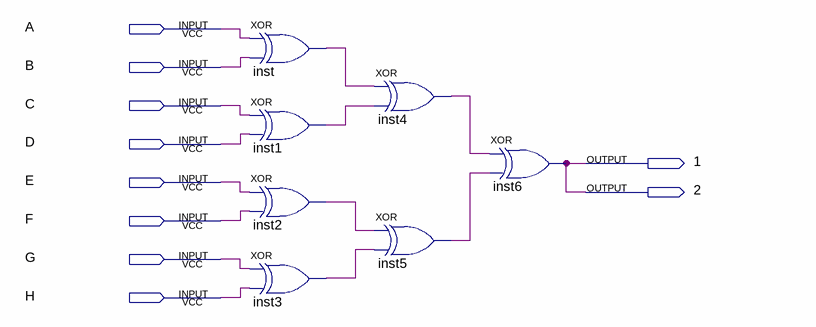
[diagram p0: schematic sheet]
// Quartus schematic parita.bdf as structural Verilog: 7 symbols, 10 pins
module parita (
  input  A,
  input  B,
  input  C,
  input  D,
  input  E,
  input  F,
  input  G,
  input  H,
  output \1 ,
  output \2 
);

  wire inst1_out, inst2_out, inst3_out, inst4_out, inst5_out, inst_out;

  xor inst (inst_out, A, B);
  xor inst1 (inst1_out, C, D);
  xor inst2 (inst2_out, E, F);
  xor inst3 (inst3_out, G, H);
  xor inst4 (inst4_out, inst_out, inst1_out);
  xor inst5 (inst5_out, inst2_out, inst3_out);
  xor inst6 (\1 , inst4_out, inst5_out);

  assign \2  = \1 ;
endmodule
